# EAGLE design snh-op1 (EAGLE 6.6.0)
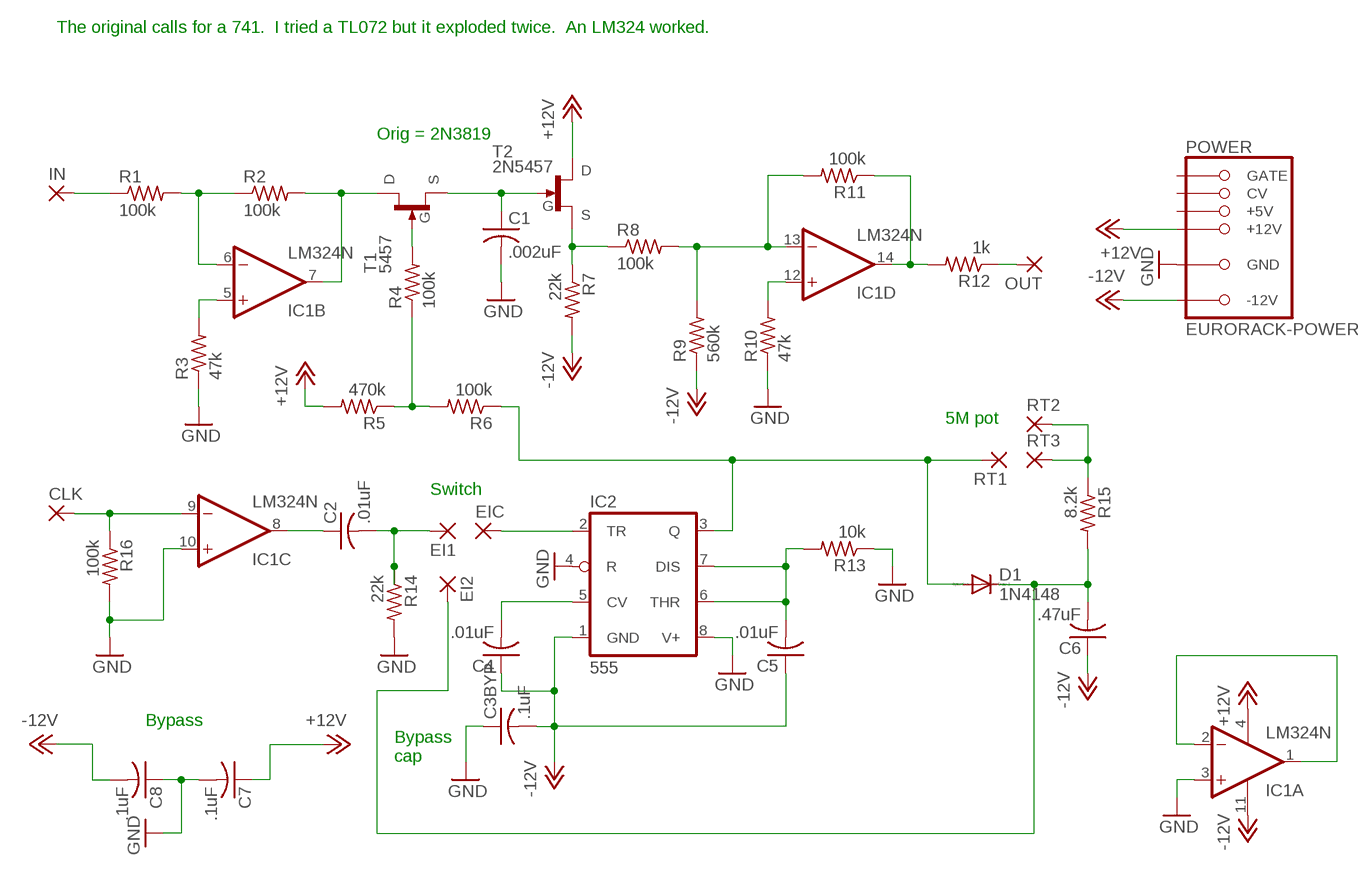
[diagram p0: schematic, sheet 1]

## Parts
C1  .002uF  C-US050-025X075  [C050-025X075]
C2  .01uF  C-US050-025X075  [C050-025X075]
C3BYP  .1uF  C-US050-025X075  [C050-025X075]
C4  .01uF  C-US050-025X075  [C050-025X075]
C5  .01uF  C-US050-025X075  [C050-025X075]
C6  .47uF  C-US050-025X075  [C050-025X075]
C7  .1uF  C-US050-025X075  [C050-025X075]
C8  .1uF  C-US050-025X075  [C050-025X075]
CLK  2,54/1,0  [2,54/1,0]
D1  1N4148  1N4148DO35-7  [DO35-7]
EI1  2,54/1,0  [2,54/1,0]
EI2  2,54/1,0  [2,54/1,0]
EIC  2,54/1,0  [2,54/1,0]
IC1  LM324N  [DIL14]
IC2  555  LM555N  [DIL08]
IN  2,54/1,0  [2,54/1,0]
OUT  2,54/1,0  [2,54/1,0]
POWER  EURORACK-POWER  [PINSHRD_PTH_2X8]
R1  100k  R-US_0207/10  [0207/10]
R2  100k  R-US_0207/10  [0207/10]
R3  47k  R-US_0207/10  [0207/10]
R4  100k  R-US_0207/10  [0207/10]
R5  470k  R-US_0207/10  [0207/10]
R6  100k  R-US_0207/10  [0207/10]
R7  22k  R-US_0207/10  [0207/10]
R8  100k  R-US_0207/10  [0207/10]
R9  560k  R-US_0207/10  [0207/10]
R10  47k  R-US_0207/10  [0207/10]
R11  100k  R-US_0207/10  [0207/10]
R12  1k  R-US_0207/10  [0207/10]
R13  10k  R-US_0207/10  [0207/10]
R14  22k  R-US_0207/10  [0207/10]
R15  8.2k  R-US_0207/10  [0207/10]
R16  100k  R-US_0207/10  [0207/10]
RT1  2,54/1,0  [2,54/1,0]
RT2  2,54/1,0  [2,54/1,0]
RT3  2,54/1,0  [2,54/1,0]
T1  5457  2N5457  [TO-92]
T2  2N5457  [TO-92]

## Nets
+12V: C7.1 IC1.4(P:V+) POWER.+12V@1(+12V) POWER.+12V@2(+12V) R5.2 T2.1(D)
-12V: C3BYP.2 C4.1 C5.1 C6.1 C8.2 IC1.11(P:V-) IC2.1(GND) POWER.-12V@1(-12V) POWER.-12V@2(-12V) R7.2 R9.1
GND: C1.2 C3BYP.1 C7.2 C8.1 IC1.3(A:+IN) IC1.10(C:+IN) IC2.4(R) IC2.8(V+) POWER.GND@1(GND) POWER.GND@2(GND) POWER.GND@3(GND) POWER.GND@4(GND) POWER.GND@5(GND) POWER.GND@6(GND) R3.1 R10.1 R13.1 R14.2 R16.2
N$1: IN.1(P) R1.1
N$2: IC1.6(B:-IN) R1.2 R2.1
N$3: IC1.5(B:+IN) R3.2
N$4: IC1.7(B:OUT) R2.2 T1.1(D)
N$5: R4.2 T1.3(G)
N$6: R4.1 R5.1 R6.2
N$7: C1.1 T1.2(S) T2.3(G)
N$8: R7.1 R8.1 T2.2(S)
N$9: IC1.13(D:-IN) R8.2 R9.2 R11.2
N$10: IC1.12(D:+IN) R10.2
N$11: IC1.14(D:OUT) R11.1 R12.2
N$12: OUT.1(P) R12.1
N$13: CLK.1(P) IC1.9(C:-IN) R16.1
N$14: C4.2 IC2.5(CV)
N$15: C2.1 IC1.8(C:OUT)
N$16: C2.2 EI1.1(P) R14.1
N$17: C5.2 IC2.6(THR) IC2.7(DIS) R13.2
N$18: C6.2 D1.C EI2.1(P) R15.2
N$20: IC1.1(A:OUT) IC1.2(A:-IN)
N$21: EIC.1(P) IC2.2(TR)
N$22: R15.1 RT2.1(P) RT3.1(P)
N$24: D1.A IC2.3(Q) R6.1 RT1.1(P)
Unconnected: POWER.+5V@1(+5V) POWER.+5V@2(+5V) POWER.CV@1(CV) POWER.CV@2(CV) POWER.GATE@1(GATE) POWER.GATE@2(GATE)

## Notes on the sheet
- The original calls for a 741.  I tried a TL072 but it exploded twice.  An LM324 worked.
- Orig = 2N3819
- 5M pot
- Switch
- Bypass
- Bypass
  cap

## Library data of the parts
C1 C2 C3BYP C4-C8 = rcl:C-US: CAPACITOR, American symbol
CLK EI1 EI2 EIC IN OUT RT1-RT3 = wirepad:2,54/1,0: THROUGH-HOLE PAD
D1 = diode:1N4148: DIODE high speed (Philips)
IC1 = linear:LM324: OP AMP
IC2 = linear:*555: TIMER
POWER = mmoretti:EURORACK-POWER
R1-R16 = rcl:R-US_: RESISTOR, American symbol
T1 T2 = transistors-random:2N54*: 2N54xx N-channel JFET

## Board
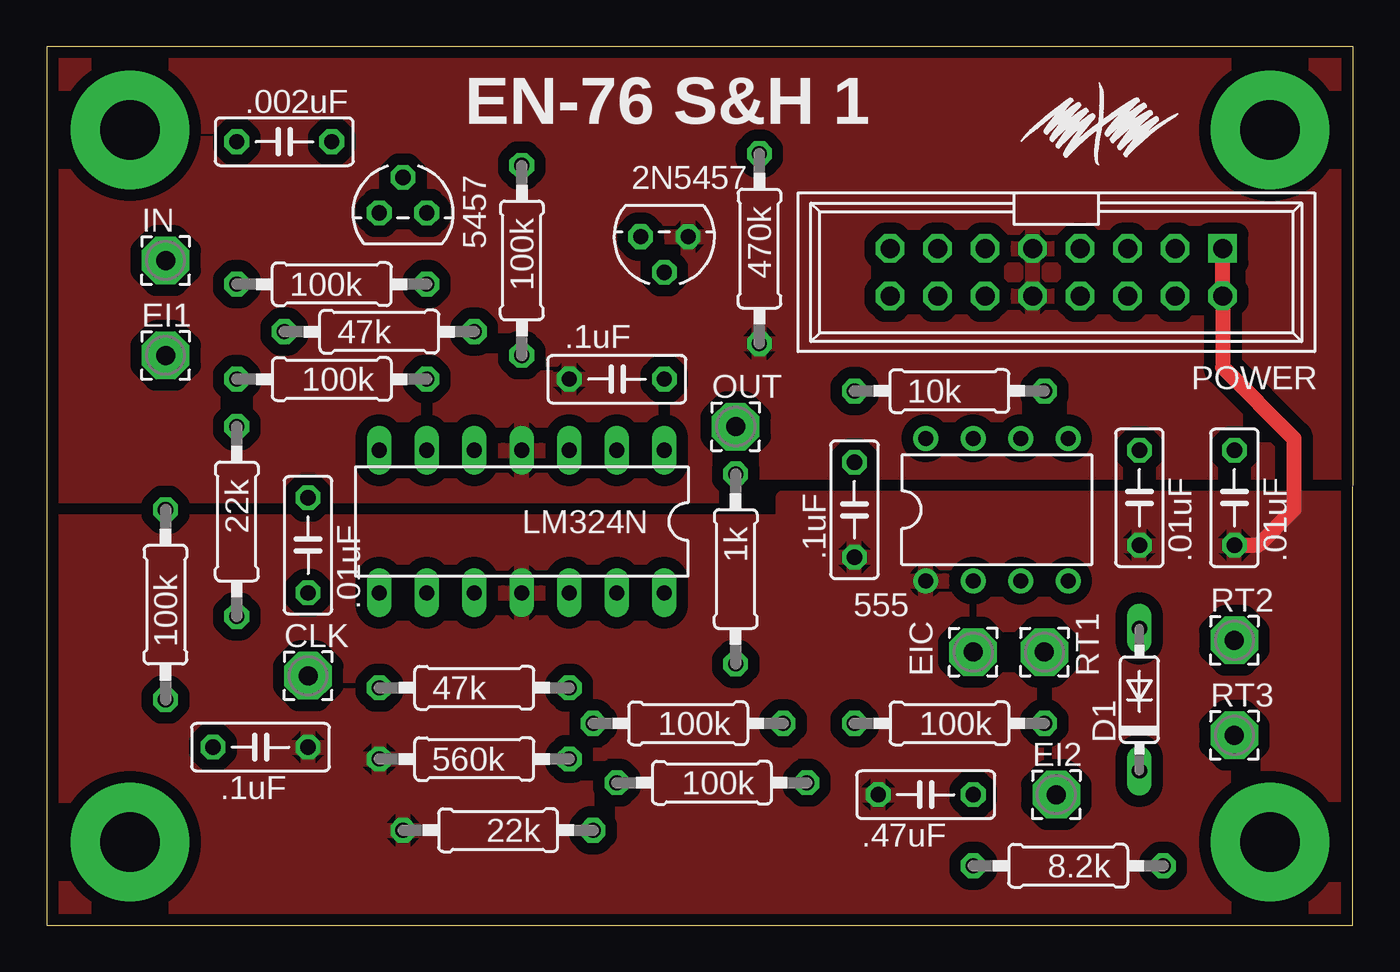
[diagram p1: board, top side]
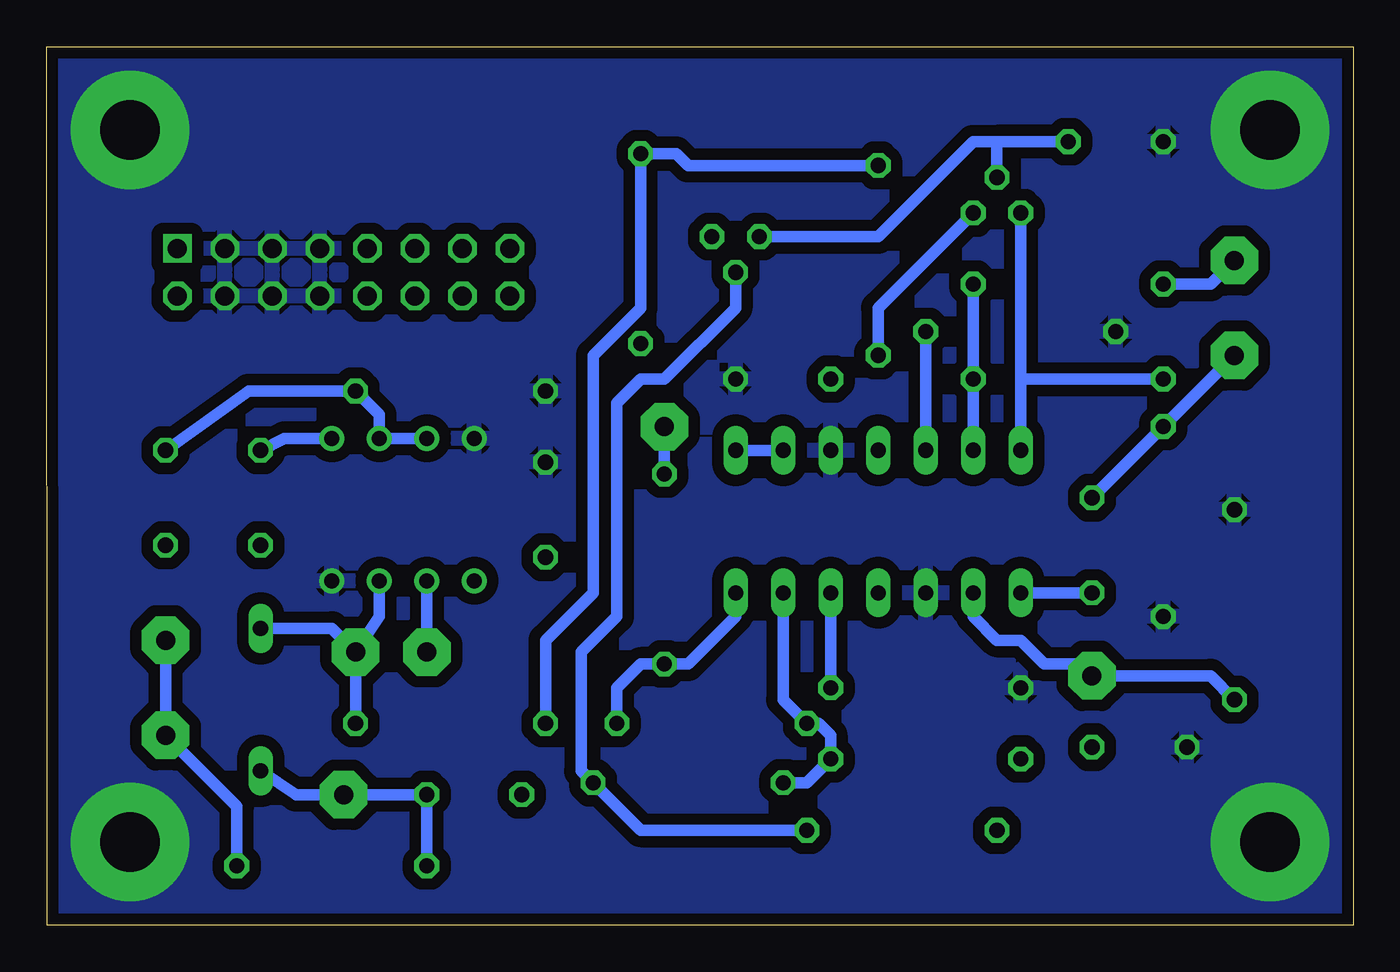
[diagram p2: board, bottom side, seen from below]

Size 69.85 x 46.99 mm. Coordinates in mm from the lower left corner, seen from the top.
Outline: 0,0 69.83,0 69.85,46.99 0,46.99 0,0
Copper layers (1*16): Top 0.035mm / dielectric 1.5mm / Bottom 0.035mm
Design rules "SeeedStudio_2layer_DRU_no_angle_20140221": minimum track width 6mil, minimum drill 12mil, track to track 6mil, track to pad 6mil, pad to pad 6mil, via to via 6mil, smd to smd 0mil, copper to edge 10mil, drill to drill 10mil, minimum pad ring 10mil, minimum via ring 6mil, stop-mask expansion 2mil, vias tented up to drill 100mil, thermal gap 10mil

### Footprints (pad centres in the part's own frame; a part is rotated, then mirrored left to right if it is on the bottom)
C050-025X075 = drill 0.813 octagon: 1 -2.54,0; 2 2.54,0
2,54/1,0 = drill 1.016 pad 2.54 octagon: 1 0,0
DO35-7 = drill 0.813 long: A 3.81,0; C -3.81,0
DIL14 = drill 0.813 long: 1 -7.62,-3.81; 2 -5.08,-3.81; 3 -2.54,-3.81; 4 0,-3.81; 5 2.54,-3.81; 6 5.08,-3.81; 7 7.62,-3.81; 8 7.62,3.81; 9 5.08,3.81; 10 2.54,3.81; 11 0,3.81; 12 -2.54,3.81; 13 -5.08,3.81; 14 -7.62,3.81
DIL08 = drill 0.813 pad 1.27: 1 -3.81,-3.81; 2 -1.27,-3.81; 3 1.27,-3.81; 4 3.81,-3.81; 5 3.81,3.81; 6 1.27,3.81; 7 -1.27,3.81; 8 -3.81,3.81
PINSHRD_PTH_2X8 = drill 1.016 octagon: +5V@1 3.81,1.27; +5V@2 3.81,-1.27; +12V@1 1.27,1.27; +12V@2 1.27,-1.27; -12V@1 -8.89,1.27; CV@1 6.35,1.27; CV@2 6.35,-1.27; GATE@1 8.89,1.27; GATE@2 8.89,-1.27; GND@1 -6.35,1.27; GND@2 -6.35,-1.27; GND@3 -3.81,1.27; GND@4 -3.81,-1.27; GND@5 -1.27,1.27; GND@6 -1.27,-1.27 | drill 1.016 square: -12V@2 -8.89,-1.27
0207/10 = drill 0.813 octagon: 1 -5.08,0; 2 5.08,0
TO-92 = drill 0.813 octagon: 1 -1.27,0; 2 0,1.905; 3 1.27,0

### Placement (x,y rotation side)
C1  12.7,41.91 180 top
C2  13.97,20.32 90 top
C3BYP  43.18,22.23 270 top
C4  58.42,22.86 90 top
C5  63.5,22.86 90 top
C6  46.99,6.99 0 top
C7  30.48,29.21 0 top
C8  11.43,9.53 0 top
CLK  13.97,13.34 0 top
D1  58.42,12.06 90 top
EI1  6.35,30.48 0 top
EI2  53.98,6.99 0 top
EIC  49.53,14.61 0 top
IC1  25.4,21.59 180 top
IC2  50.8,22.23 0 top
IN  6.35,35.56 0 top
OUT  36.83,26.67 0 top
POWER  53.98,34.92 180 top
R1  15.24,34.29 0 top
R2  15.24,29.21 180 top
R3  17.78,31.75 0 top
R4  25.4,35.56 270 top
R5  38.1,36.2 270 top
R6  48.26,10.79 180 top
R7  24.13,5.08 180 top
R8  35.56,7.62 180 top
R9  22.86,8.89 0 top
R10  22.86,12.7 0 top
R11  34.29,10.79 180 top
R12  36.83,19.05 270 top
R13  48.26,28.57 0 top
R14  10.16,21.59 270 top
R15  54.61,3.17 180 top
R16  6.35,17.14 90 top
RT1  53.34,14.61 0 top
RT2  63.5,15.24 0 top
RT3  63.5,10.16 0 top
T1  19.05,38.1 0 top
T2  33.02,36.83 180 top

### Tracks (layer width: path | path; a pad name or v marks a point on that pad's centre or on a via)
+12V
  pour Top (isolate 0.61, rank 2): 0,46.99 69.85,46.99 69.85,22.86 39.37,22.86 39.37,21.59 0,21.59
-12V
  Top 0.813: C5.1 64.77,20.32 66.67,22.23 66.67,26.04 62.87,29.84 POWER.-12V@1 POWER.-12V@2
  pour Top (isolate 0.61): 0,21.59 39.37,21.59 39.37,22.86 69.85,22.86 69.85,0 0,0
GND  (via drill 3.17 pad 6.35)
  other vias: 4.45,42.55 4.45,4.45 65.41,4.45 65.41,42.55
  pour Bottom (isolate 0.61): 0,46.99 69.85,46.99 69.85,0 0,0
N$1
  Bottom 0.61: R1.1 7.62,34.29 IN.1
N$2
  Bottom 0.61: R1.2 R2.1 IC1.6
N$3
  Bottom 0.61: IC1.5 R3.2
N$4
  Bottom 0.61: IC1.7 17.78,29.21 | 17.78,29.21 R2.2 | T1.1 17.78,29.21
N$5
  Bottom 0.61: T1.3 25.4,33.02 R4.2
N$6
  Bottom 0.61: R6.2 43.18,15.24 40.64,17.78 40.64,30.48 38.1,33.02 R5.1 36.2,41.27 35.56,40.64 R4.1
N$7
  Bottom 0.61: C1.1 19.05,41.91 | 19.05,41.91 T1.2 | T2.3 25.4,36.83 20.32,41.91 19.05,41.91
N$8
  Bottom 0.61: R7.1 38.1,5.08 R8.1 41.27,8.26 41.27,14.61 39.37,16.51 39.37,27.94 38.1,29.21 36.83,29.21 33.02,33.02 T2.2
N$9
  Bottom 0.61: IC1.13 30.48,12.06 R11.2 28.57,10.79 27.94,10.16 R9.2 29.21,7.62 R8.2
N$10
  Bottom 0.61: R10.2 IC1.12
N$11
  Bottom 0.61: IC1.14 33.02,16.51 35.56,13.97 R12.2 38.1,13.97 39.37,12.7 R11.1
N$12
  Bottom 0.61: R12.1 OUT.1
N$13
  Bottom 0.61: IC1.9 20.32,16.51 19.05,15.24 17.78,15.24 16.51,13.97 14.61,13.97 CLK.1 7.62,13.34 R16.1
N$14
  Bottom 0.61: IC2.5 57.15,26.04 C4.2
N$15
  Bottom 0.61: IC1.8 C2.1
N$16
  Bottom 0.61: EI1.1 R14.1 C2.2
N$17
  Bottom 0.61: IC2.7 IC2.6 52.07,27.3 R13.2 59.05,28.57 C5.2
N$18
  Bottom 0.61: R15.2 C6.2 EI2.1 56.52,6.99 D1.C
N$20
  Bottom 0.61: IC1.1 IC1.2
N$21
  Bottom 0.61: IC2.2 EIC.1
N$22
  Bottom 0.61: R15.1 59.69,6.35 RT3.1 RT2.1
N$24
  Bottom 0.61: IC2.3 52.07,16.51 RT1.1 | RT1.1 R6.1 | D1.A 54.61,15.88 RT1.1

### Text on the board
tPlace: EN-76 S&H 1